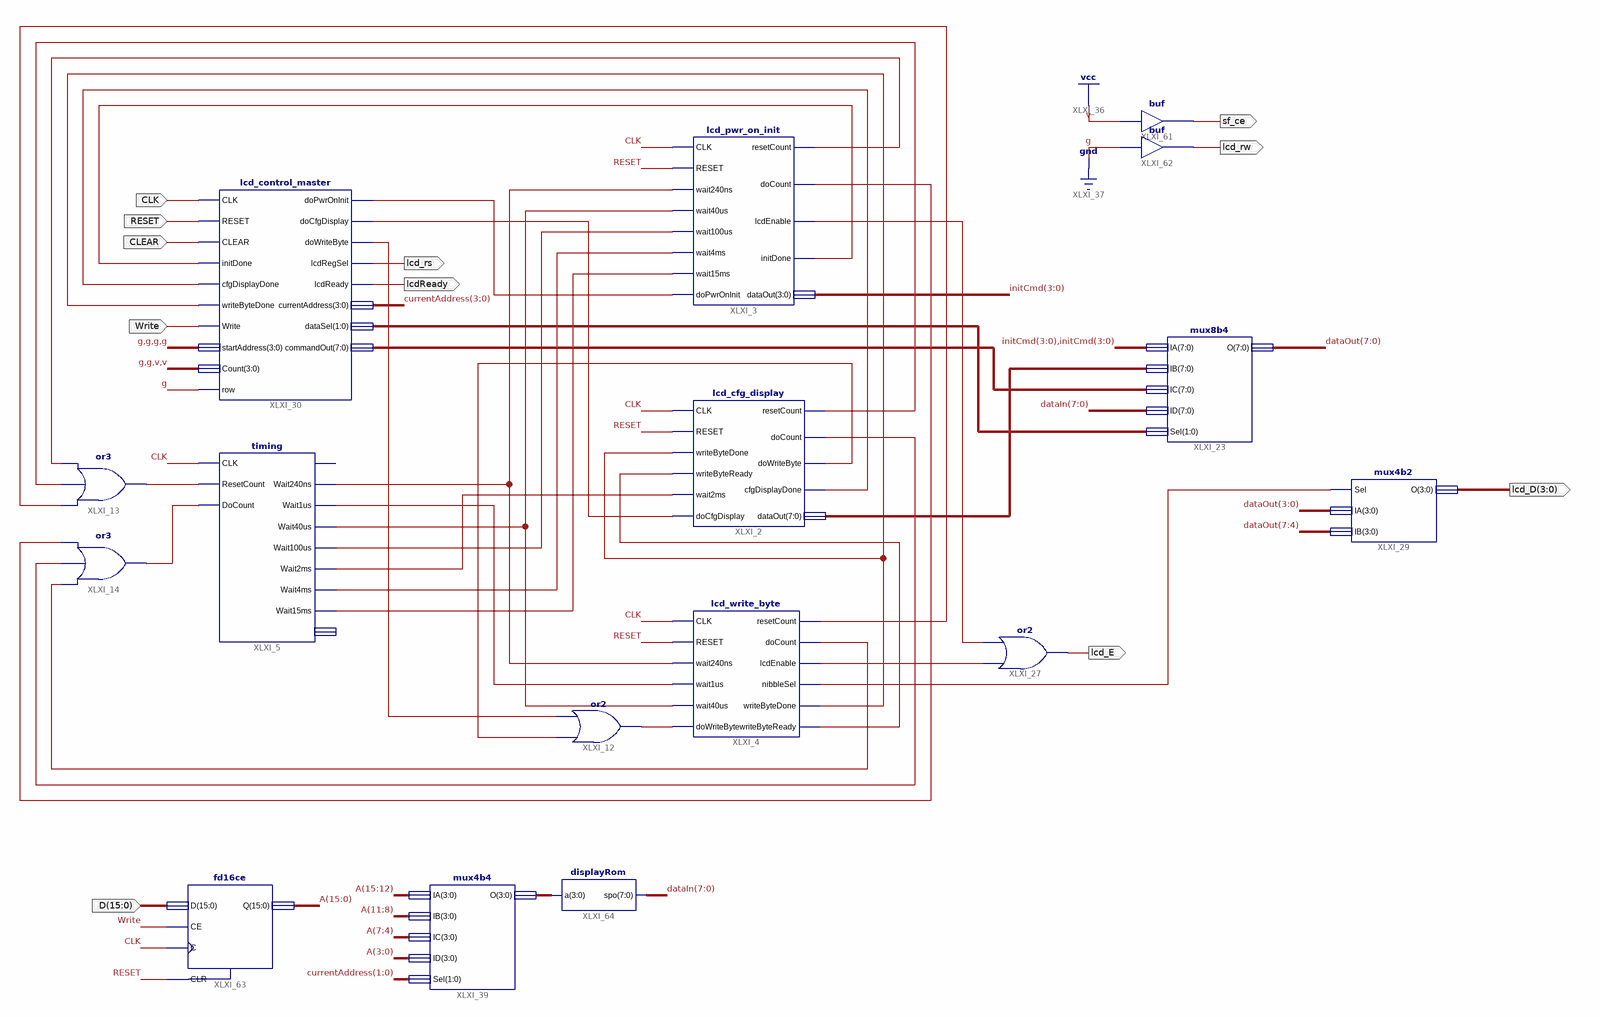
[diagram p0: schematic sheet 1]
// Xilinx ISE schematic lcd_driver.sch (spartan3e) as structural Verilog: 16 symbols, 11 ports
module lcd_driver (
  input  CLK,
  input  RESET,
  input  CLEAR,
  input  Write,
  input  [15:0] D,
  output lcd_E,
  output lcd_rs,
  output lcdReady,
  output [3:0] lcd_D,
  output sf_ce,
  output lcd_rw
);

  wire doCfgDisplay, doPwrOnInit, doWriteByte, XLXN_24, XLXN_26, XLXN_27, XLXN_28, XLXN_29, XLXN_30, XLXN_32,
       XLXN_36, XLXN_38, XLXN_39, XLXN_40, XLXN_41, XLXN_42, XLXN_43, XLXN_44, XLXN_45, XLXN_46, XLXN_47,
       XLXN_48, XLXN_49, XLXN_95, XLXN_120, XLXN_121, XLXN_133;
  wire [1:0] dataSel;
  wire [3:0] currentAddress, initCmd, XLXN_195;
  wire [7:0] dataIn, dataOut, XLXN_102, XLXN_137;
  wire [15:0] A;

  timing XLXI_5 (
    .CLK(CLK), .DoCount(XLXN_42), .ResetCount(XLXN_41), .Wait240ns(XLXN_24), .Wait1us(XLXN_32),
    .Wait40us(XLXN_26), .Wait100us(XLXN_27), .Wait2ms(XLXN_30), .Wait15ms(XLXN_29), .Wait4ms(XLXN_28));  // open: Wait40ns, CNT
  lcd_pwr_on_init XLXI_3 (
    .CLK(CLK), .RESET(RESET), .wait240ns(XLXN_24), .wait40us(XLXN_26), .wait100us(XLXN_27),
    .wait4ms(XLXN_28), .wait15ms(XLXN_29), .doPwrOnInit(doPwrOnInit), .resetCount(XLXN_43),
    .doCount(XLXN_48), .lcdEnable(XLXN_120), .initDone(XLXN_49), .dataOut(initCmd));
  lcd_cfg_display XLXI_2 (
    .CLK(CLK), .RESET(RESET), .writeByteDone(XLXN_39), .writeByteReady(XLXN_40), .wait2ms(XLXN_30),
    .doCfgDisplay(doCfgDisplay), .resetCount(XLXN_44), .doCount(XLXN_47), .doWriteByte(XLXN_38),
    .cfgDisplayDone(XLXN_95), .dataOut(XLXN_102));
  lcd_write_byte XLXI_4 (
    .CLK(CLK), .RESET(RESET), .wait240ns(XLXN_24), .wait1us(XLXN_32), .wait40us(XLXN_26),
    .doWriteByte(XLXN_36), .resetCount(XLXN_45), .doCount(XLXN_46), .lcdEnable(XLXN_121),
    .nibbleSel(XLXN_133), .writeByteDone(XLXN_39), .writeByteReady(XLXN_40));
  or XLXI_12 (XLXN_36, XLXN_38, doWriteByte);
  or XLXI_14 (XLXN_42, XLXN_46, XLXN_47, XLXN_48);
  or XLXI_13 (XLXN_41, XLXN_45, XLXN_44, XLXN_43);
  mux8b4 XLXI_23 (.IA({initCmd, initCmd}), .IB(XLXN_102), .IC(XLXN_137), .ID(dataIn), .Sel(dataSel), .O(dataOut));
  or XLXI_27 (lcd_E, XLXN_121, XLXN_120);
  mux4b2 XLXI_29 (.Sel(XLXN_133), .IA(dataOut[3:0]), .IB(dataOut[7:4]), .O(lcd_D));
  lcd_control_master XLXI_30 (
    .CLK(CLK), .RESET(RESET), .CLEAR(CLEAR), .initDone(XLXN_49), .cfgDisplayDone(XLXN_95),
    .writeByteDone(XLXN_39), .Write(Write), .row(1'b0), .startAddress(4'b0000), .Count(4'b0011),
    .doPwrOnInit(doPwrOnInit), .doCfgDisplay(doCfgDisplay), .doWriteByte(doWriteByte), .lcdRegSel(lcd_rs),
    .lcdReady(lcdReady), .currentAddress(currentAddress), .dataSel(dataSel), .commandOut(XLXN_137));
  mux4b4 XLXI_39 (.IA(A[15:12]), .IB(A[11:8]), .IC(A[7:4]), .ID(A[3:0]), .Sel(currentAddress[1:0]), .O(XLXN_195));
  buf XLXI_61 (sf_ce, 1'b1);
  buf XLXI_62 (lcd_rw, 1'b0);
  fd16ce XLXI_63 (.C(CLK), .CE(Write), .CLR(RESET), .D(D), .Q(A));
  displayRom XLXI_64 (.a(XLXN_195), .spo(dataIn));
endmodule
